# Altium schematic sheet Matrixkeypad.SchDoc
size A4; SheetNumber: 4; SheetTotal: 22
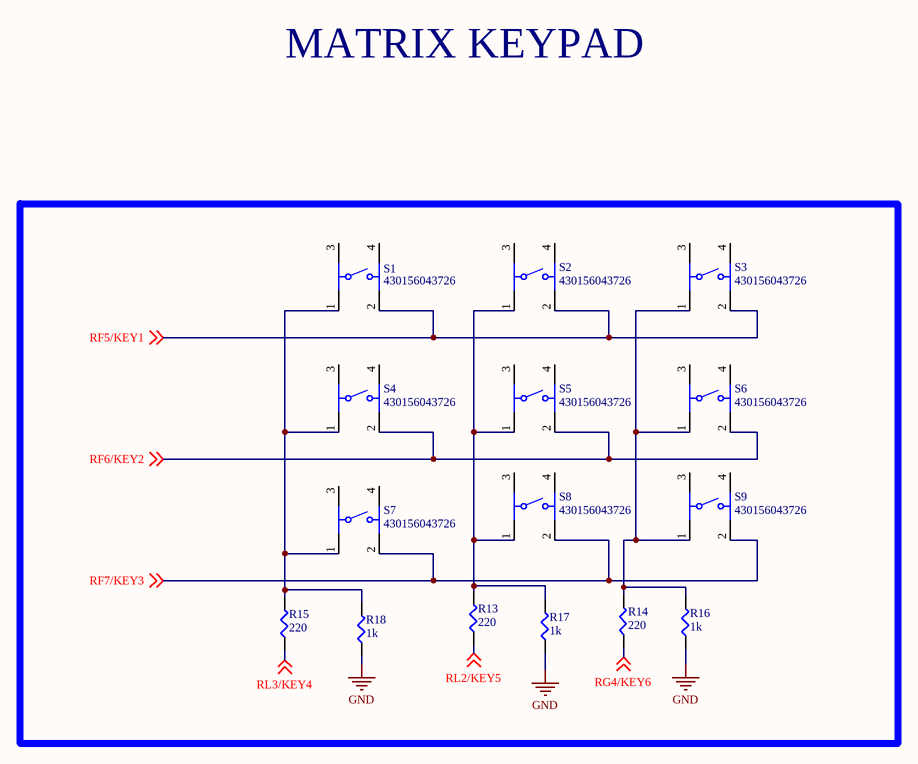
[diagram p0: Matrixkeypad.SchDoc]

## Parts
R13  220  [SMD-0805-RES]
R14  220  [SMD-0805-RES]
R15  220  [SMD-0805-RES]
R16  1k  [SMD-0805-RES]
R17  1k  [SMD-0805-RES]
R18  1k  [SMD-0805-RES]
S1  430156043726  [4301x60437x6]
S2  430156043726  [4301x60437x6]
S3  430156043726  [4301x60437x6]
S4  430156043726  [4301x60437x6]
S5  430156043726  [4301x60437x6]
S6  430156043726  [4301x60437x6]
S7  430156043726  [4301x60437x6]
S8  430156043726  [4301x60437x6]
S9  430156043726  [4301x60437x6]

## Nets
GND: R16.1 R17.1 R18.1
RF5/KEY1: S1.2 S2.2 S3.2 ; off-sheet RF5/KEY1
RF6/KEY2: S4.2 S5.2 S6.2 ; off-sheet RF6/KEY2
RF7/KEY3: S7.2 S8.2 S9.2 ; off-sheet RF7/KEY3
RG4/KEY6: R14.1 ; off-sheet RG4/KEY6
RL2/KEY5: R13.1 ; off-sheet RL2/KEY5
RL3/KEY4: R15.1 ; off-sheet RL3/KEY4
NetR13_2: R13.2 R17.2 S2.1 S5.1 S8.1
NetR14_2: R14.2 R16.2 S3.1 S6.1 S9.1
NetR15_2: R15.2 R18.2 S1.1 S4.1 S7.1

Not connected (* = marked no-connect by the designer): S1 3 4; S2 3 4; S3 3 4; S4 3 4; S5 3 4; S6 3 4; S7 3 4; S8 3 4; S9 3 4

## Notes on the sheet
- MATRIX KEYPAD

## Library data of the parts
R13-R15 = ERJ-6ENF2200V: RES SMD 220 OHM 1% 1/8W 0805; Manufacturer: Panasonic Electronic Components; Factory Stock: 0; Unit Price (USD): 0.00729; @ qty: 1500; Minimum Quantity: 1; Power (Watts): 0.125W, 1/8W; Temperature Coefficient: ±100ppm/°C; Part Number: ERJ-6ENF2200V; Datasheets: http://industrial.panasonic.com/www-cgi/jvcr13pz.cgi?E+PZ+3+AOA0002+ERJ6ENF2200V+7+WW; Image: //media.digikey.com/Renders/Panasonic%20Renders/ERJ-0805%20Pkg.jpg; Digi-Key Part Number: P220CCT-ND; Quantity Available: 111570; Packaging: Cut Tape (CT); Series: ERJ; Part Status: Active; Value: 220; Tolerance: ±1%; Composition: Thick Film; Features: Automotive AEC-Q200; Operating Temperature: -55°C ~ 155°C; Package / Case: 0805 (2012 Metric); Supplier Device Package: 0805; Size / Dimension: 0.079" L x 0.049" W (2.00mm x 1.25mm); Height - Seated (Max): 0.028" (0.70mm); Number of Terminations: 2; Failure Rate: -
R16-R18 = ERJ-6ENF1001V: RES SMD 1K OHM 1% 1/8W 0805; Manufacturer: Panasonic Electronic Components; Factory Stock: 0; Unit Price (USD): 0.00729; @ qty: 1500; Minimum Quantity: 1; Power (Watts): 0.125W, 1/8W; Temperature Coefficient: ±100ppm/°C; Part Number: ERJ-6ENF1001V; Datasheets: http://industrial.panasonic.com/www-cgi/jvcr13pz.cgi?E+PZ+3+AOA0002+ERJ6ENF1001V+7+WW; Image: //media.digikey.com/Renders/Panasonic%20Renders/ERJ-0805%20Pkg.jpg; Digi-Key Part Number: P1.00KCCT-ND; Quantity Available: 12895103; Packaging: Cut Tape (CT); Series: ERJ; Part Status: Active; Value: 1k; Tolerance: ±1%; Composition: Thick Film; Features: Automotive AEC-Q200; Operating Temperature: -55°C ~ 155°C; Package / Case: 0805 (2012 Metric); Supplier Device Package: 0805; Size / Dimension: 0.079" L x 0.049" W (2.00mm x 1.25mm); Height - Seated (Max): 0.028" (0.70mm); Number of Terminations: 2; Failure Rate: -
S1-S9 = 430156043726: WS-TATV THT Tact Switch 6x6mm, height 4.3mm, 260gf; Rated Voltage: 12VDC; Rated Current: 50mA; Washable: No; ComponentLink1Description: Manufacturer; ComponentLink1URL: http://www.we-online.de; ComponentLink2Description: Datasheet; ComponentLink2URL: https://katalog.we-online.com/em/datasheet/430156043726.pdf; Operating Temperature: -40 to +85degC; Part Number: 430156043726; Published Date: September 2019; Contact Material: Stainless Steel; Height: 4.3mm; Mounting Technology: THT; Contact Plating: Silver; Operation Force: 260gf; Packaging: Bulk; Terminal Material: Copper Alloy; Publisher: Wurth Elektronik; Terminal Plating: Silver